# EAGLE design ContactlessIndi (EAGLE 9.6.2)
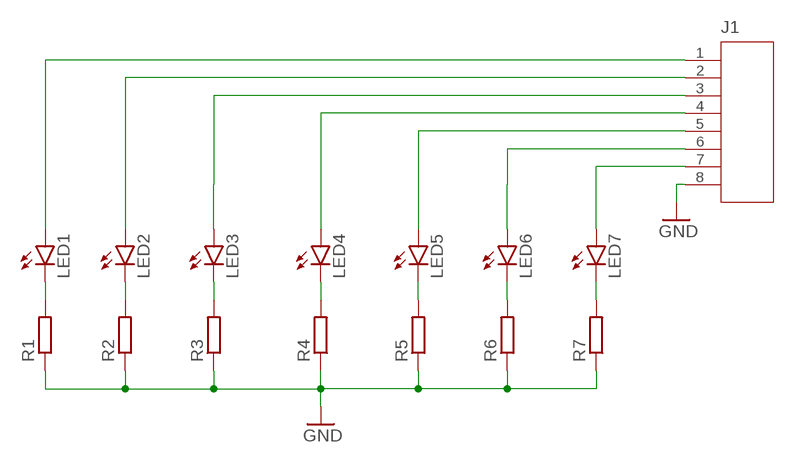
[diagram p0: schematic, sheet 1]

## Parts
J1  PINHEADER-818*1  [PINHEADER-8*1]
LED1  LED5MM  [LED5MM]
LED2  LED5MM  [LED5MM]
LED3  LED5MM  [LED5MM]
LED4  LED5MM  [LED5MM]
LED5  LED5MM  [LED5MM]
LED6  LED5MM  [LED5MM]
LED7  LED5MM  [LED5MM]
R1  R-EU_R1206  [R1206]
R2  R-EU_R1206  [R1206]
R3  R-EU_R1206  [R1206]
R4  R-EU_R1206  [R1206]
R5  R-EU_R1206  [R1206]
R6  R-EU_R1206  [R1206]
R7  R-EU_R1206  [R1206]

## Nets
GND: J1.8 R1.1 R2.1 R3.1 R4.1 R5.1 R6.1 R7.1
N$1: LED1.K(C) R1.2
N$2: LED2.K(C) R2.2
N$3: LED3.K(C) R3.2
N$4: LED4.K(C) R4.2
N$5: LED5.K(C) R5.2
N$6: LED6.K(C) R6.2
N$7: LED7.K(C) R7.2
N$8: J1.7 LED7.A
N$9: J1.6 LED6.A
N$10: J1.5 LED5.A
N$11: J1.4 LED4.A
N$12: J1.3 LED3.A
N$13: J1.2 LED2.A
N$14: J1.1 LED1.A

## Library data of the parts
J1 = PINHEADER:PINHEADER-8*1
LED1-LED7 = led:LED: LED OSRAM: - CHIPLED LG R971, LG N971, LY N971, LG Q971, LY Q971, LO R971, LY R971 LH N974, LH R974 LS Q976, LO Q976, LY Q976 LO Q996 - Hyper CHIPLED LW Q18S LB Q993, LB Q99A, LB R99A - SideLED LS A670, LO A670, LY A670, LG A670, LP A670 LB A673, LV A673, LT A673, LW A673 LH A674 LY A675 LS A676, LA A676, LO A676, LY A676, LW A676 LS A679, LY A679, LG A679 - Hyper Micro SIDELED® LS Y876, LA Y876, LO Y876, LY Y876 LT Y87S - SmartLED LW L88C, LW L88S LB L89C, LB L89S, LG L890 LS L89K, LO L89K, LY L89K LS L896, LA L896, LO L896, LY L896 - TOPLED LS T670, LO T670, LY T670, LG T670, LP T670 LSG T670, LSP T670, LSY T670, LOP T670, LYG T670 LG T671, LOG T671, LSG T671 LB T673, LV T673, LT T673, LW T673 LH T674 LS T676, LA T676, LO T676, LY T676, LB T676, LH T676, LSB T676, LW T676 LB T67C, LV T67C, LT T67C, LS T67K, LO T67K, LY T67K, LW E67C LS E67B, LA E67B, LO E67B, LY E67B, LB E67C, LV E67C, LT E67C LW T67C LS T679, LY T679, LG T679 LS T770, LO T770, LY T770, LG T770, LP T770 LB T773, LV T773, LT T773, LW T773 LH T774 LS E675, LA E675, LY E675, LS T675 LS T776, LA T776, LO T776, LY T776, LB T776 LHGB T686 LT T68C, LB T68C - Hyper Mini TOPLED® LB M676 - Mini TOPLED Santana® LG M470 LS M47K, LO M47K, LY M47K Source: http://www.osram.convergy.de LUXEON: - LUMILED® LXK2-PW12-R00, LXK2-PW12-S00, LXK2-PW14-U00, LXK2-PW14-V00 LXK2-PM12-R00, LXK2-PM12-S00, LXK2-PM14-U00 LXK2-PE12-Q00, LXK2-PE12-R00, LXK2-PE12-S00, LXK2-PE14-T00, LXK2-PE14-U00 LXK2-PB12-K00, LXK2-PB12-L00, LXK2-PB12-M00, LXK2-PB14-N00, LXK2-PB14-P00, LXK2-PB14-Q00 LXK2-PR12-L00, LXK2-PR12-M00, LXK2-PR14-Q00, LXK2-PR14-R00 LXK2-PD12-Q00, LXK2-PD12-R00, LXK2-PD12-S00 LXK2-PH12-R00, LXK2-PH12-S00 LXK2-PL12-P00, LXK2-PL12-Q00, LXK2-PL12-R00 Source: www.luxeon.com KINGBRIGHT: KA-3528ASYC Source: www.kingbright.com
R1-R7 = rcl:R-EU_: RESISTOR, European symbol; SPICEPREFIX: R

## Board
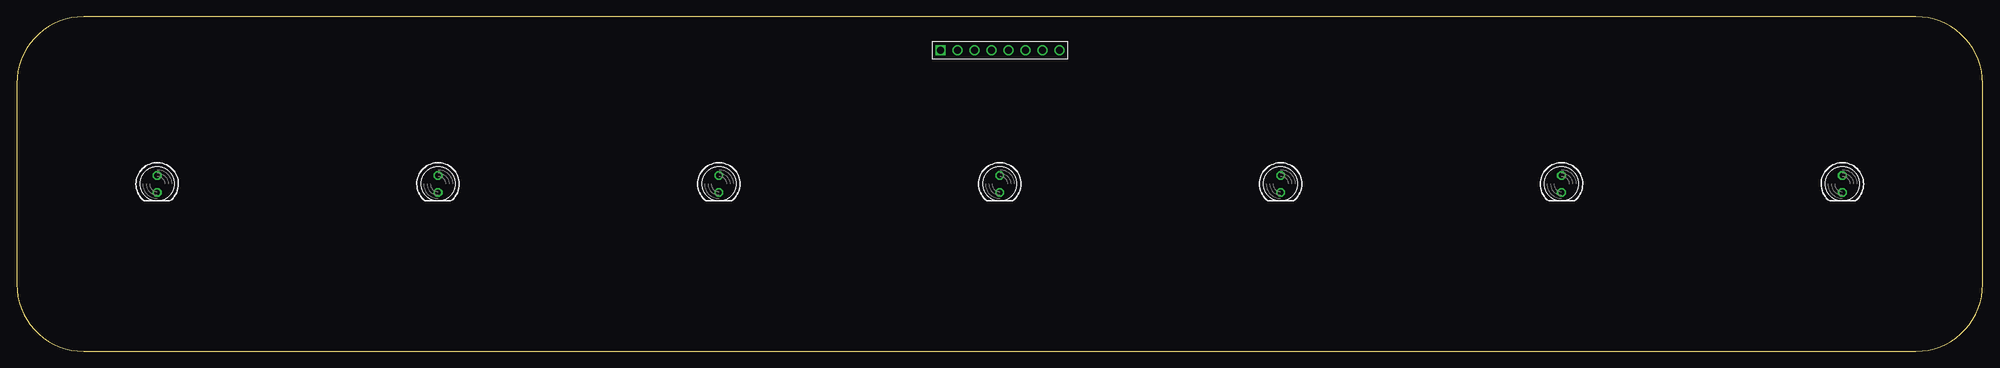
[diagram p1: board, top side]
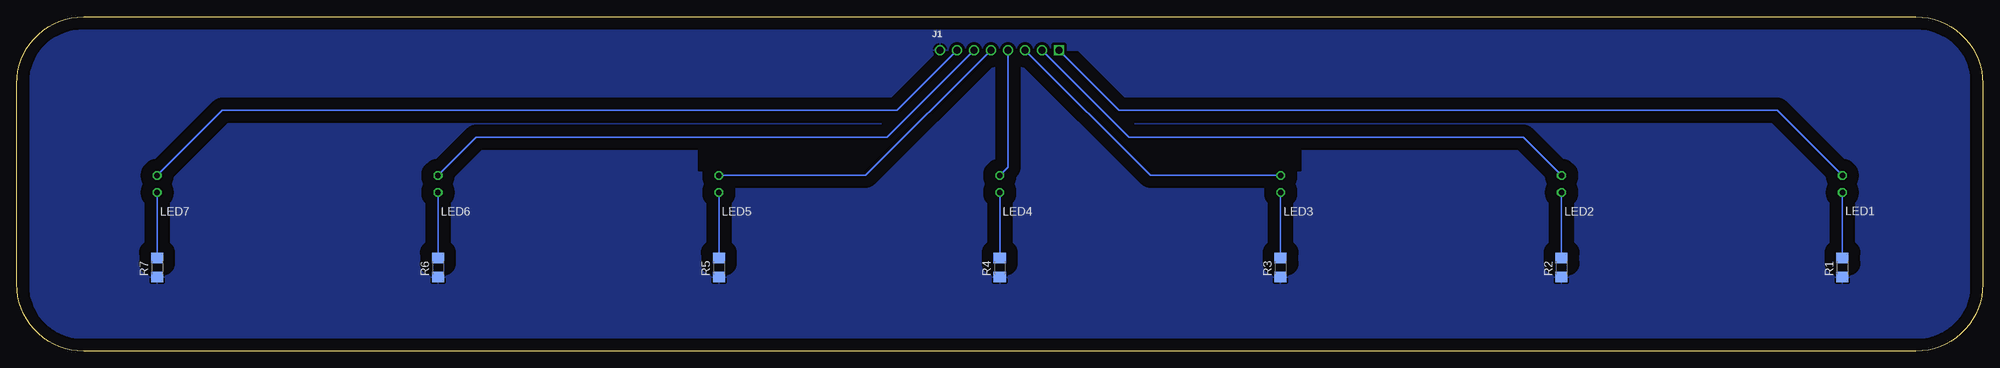
[diagram p2: board, bottom side, seen from below]

Size 294 x 50 mm. Coordinates in mm from the lower left corner, seen from the top.
Outline: 10,0 284,0 arc90 294,10 294,40 arc90 284,50 10,50 arc90 0,40 0,10 arc90 10,0
Copper layers (1*16): Top 0.035mm / dielectric 1.5mm / Bottom 0.035mm
Design rules "default": minimum track width 6mil, minimum drill 0.35mm, track to track 6mil, track to pad 6mil, pad to pad 6mil, via to via 6mil, smd to smd 6mil, copper to edge 40mil, drill to drill 6mil, minimum pad ring 10mil, minimum via ring 8mil, stop-mask expansion 4mil, vias tented up to drill 0mil, thermal gap 10mil

### Footprints (pad centres in the part's own frame; a part is rotated, then mirrored left to right if it is on the bottom)
PINHEADER-8*1 = drill 1.02 square: 1 -6.35,0 | drill 1.02: 2 -3.81,0; 3 -1.27,0; 4 1.27,0; 5 3.81,0; 6 6.35,0; 7 8.89,0; 8 11.43,0
LED5MM = drill 0.813 octagon: A -1.27,0; K 1.27,0
R1206 = smd 1.6 x 1.803: 1 -1.422,0; 2 1.422,0

### Placement (x,y rotation side)
J1  144.5,45 0 top
LED1  21,25 270 top
LED2  63,25 270 top
LED3  105,25 270 top
LED4  147,25 270 top
LED5  189,25 270 top
LED6  231,25 270 top
LED7  273,25 270 top
R1  21,12.5 90 bottom
R2  63,12.5 90 bottom
R3  105,12.5 90 bottom
R4  147,12.5 90 bottom
R5  189,12.5 90 bottom
R6  231,12.5 90 bottom
R7  273,12.5 90 bottom

### Tracks (layer width: path | path; a pad name or v marks a point on that pad's centre or on a via)
GND
  pour Bottom (isolate 1.778): 6,48 2,44 2,42 2,5 5,2 289,2 292,5 292,44 288,48
  cutout Bottom: 127,30 102,30 102,27 124,27
  cutout Bottom: 166,30 192,30 192,27 169,27
  pour Bottom (isolate 0.406): 158,48 158,45 135,45 135,48
N$1
  Bottom 0.254: LED1.K R1.2
N$2
  Bottom 0.254: LED2.K R2.2
N$3
  Bottom 0.254: LED3.K R3.2
N$4
  Bottom 0.254: LED4.K R4.2
N$5
  Bottom 0.254: LED5.K R5.2
N$6
  Bottom 0.254: LED6.K R6.2
N$7
  Bottom 0.254: LED7.K R7.2
N$8
  Bottom 0.254: J1.7 162.39,36 263.27,36 LED7.A
N$9
  Bottom 0.254: J1.6 163.85,32 225.27,32 LED6.A
N$10
  Bottom 0.254: LED5.A 167.04,26.27 J1.5
N$11
  Bottom 0.254: J1.4 145.77,27.5 LED4.A
N$12
  Bottom 0.254: LED3.A 124.5,26.27 J1.3
N$13
  Bottom 0.254: J1.2 127.69,32 68.73,32 LED2.A
N$14
  Bottom 0.254: J1.1 129.15,36 30.73,36 LED1.A